# EAGLE design Fake6523 (EAGLE 7.7.0)

## Sheet 1 of 3: LOGIC
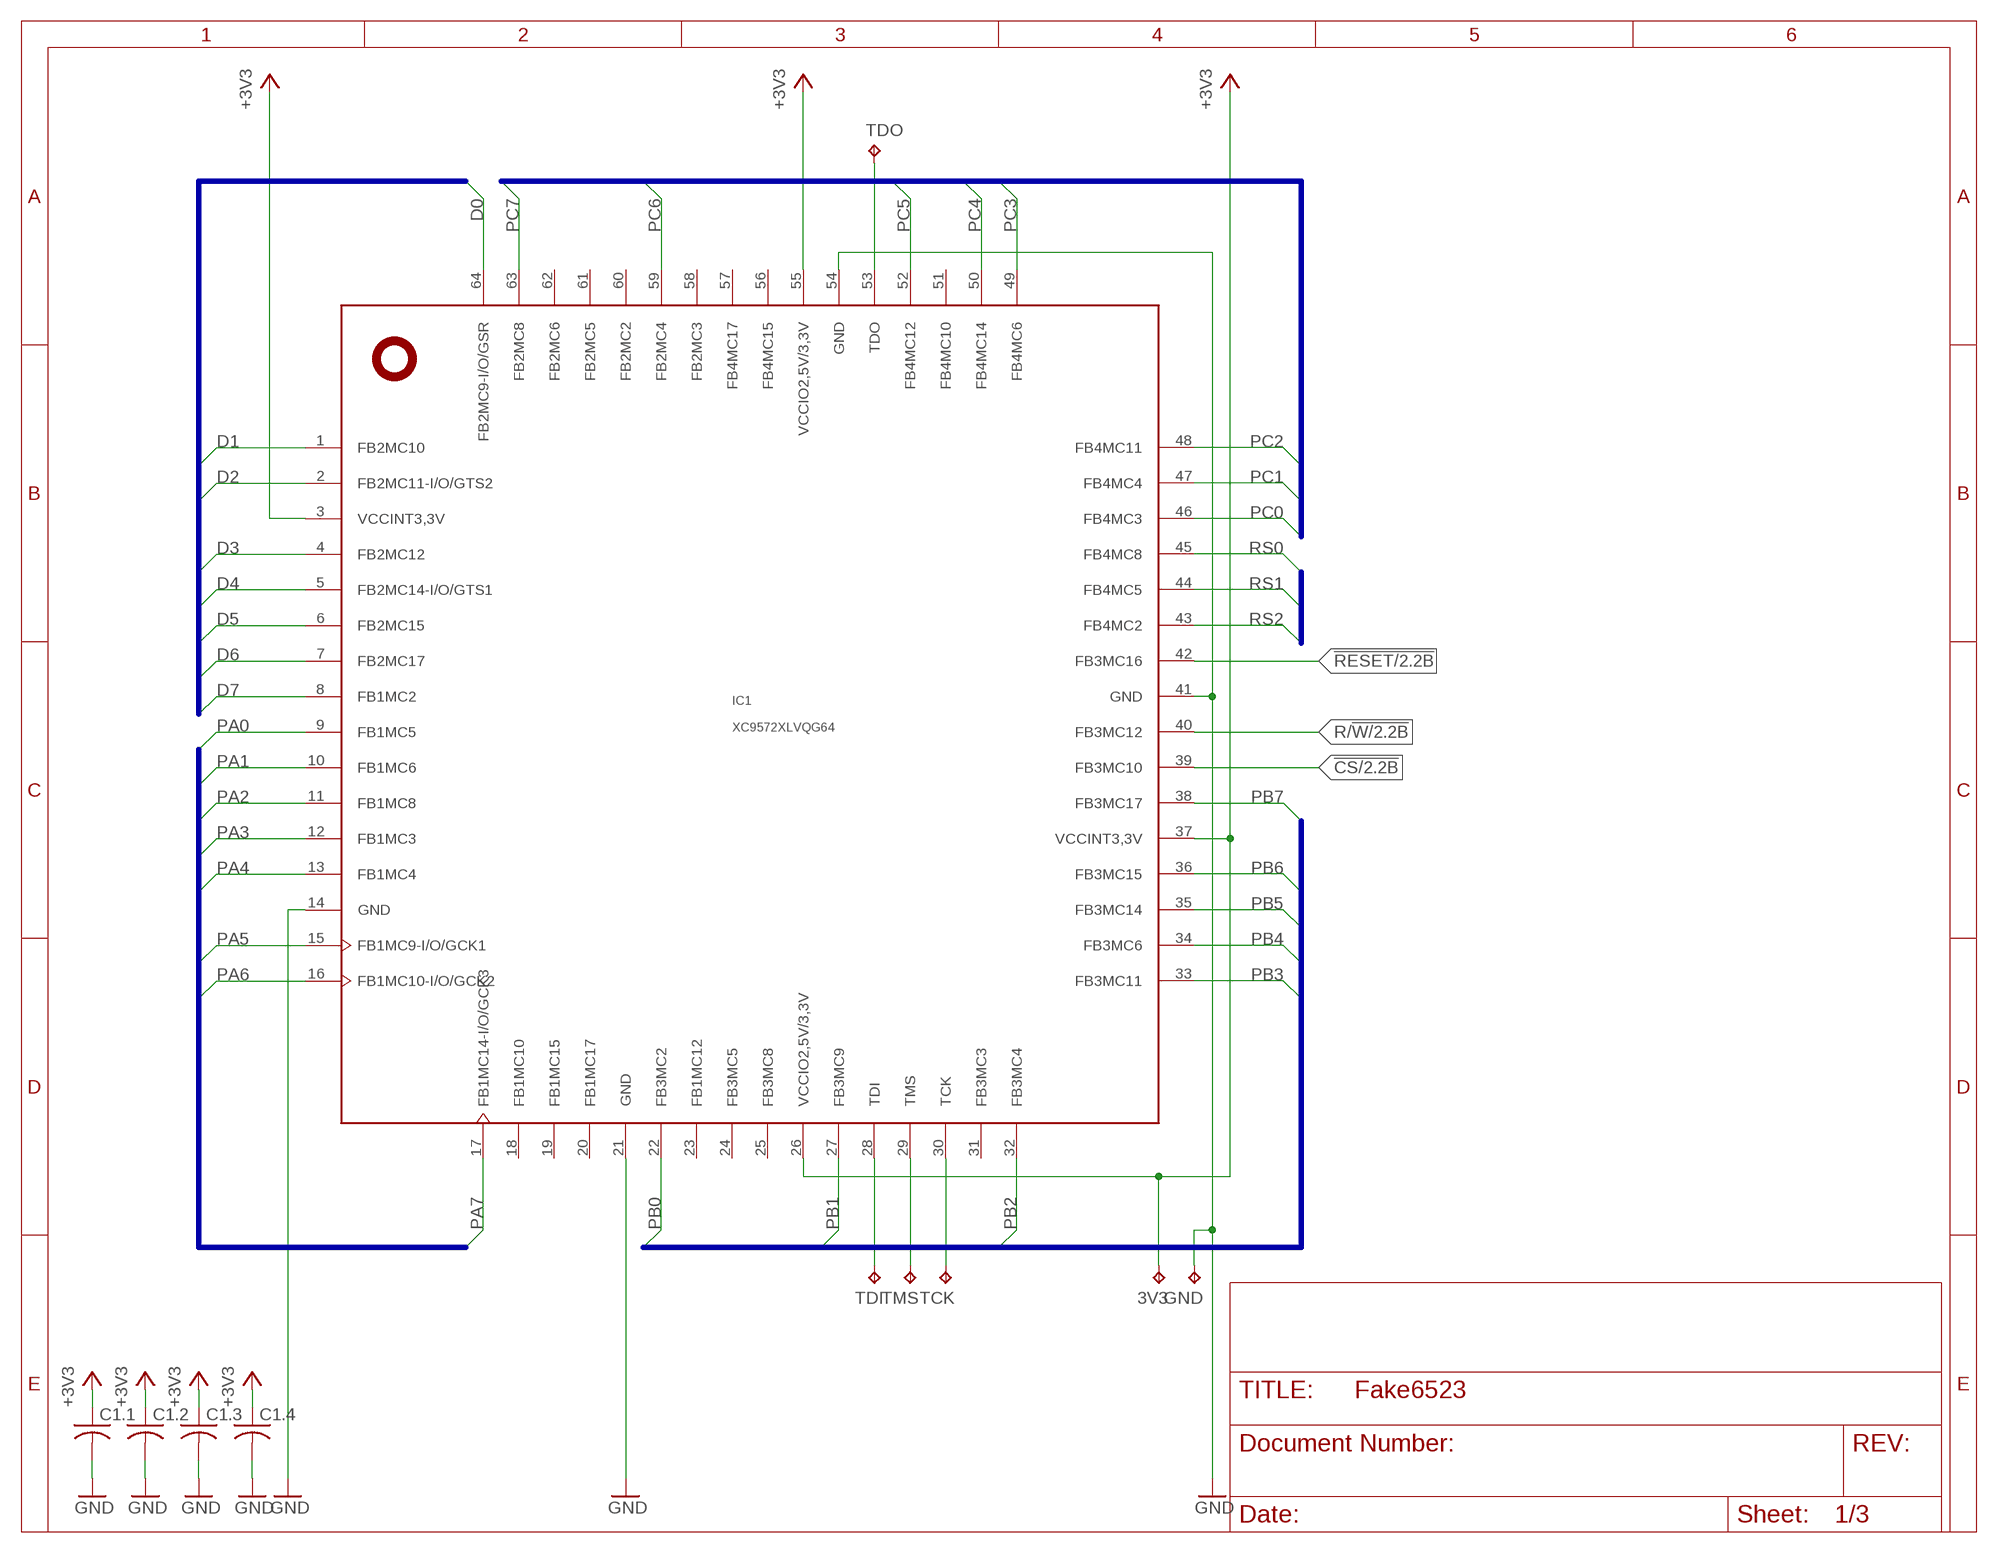
[diagram p0: schematic, sheet 1]

### Parts
3V3  TPTP08R  [TP08R]
C1.1  C-USC0402  [C0402]
C1.2  C-USC0402  [C0402]
C1.3  C-USC0402  [C0402]
C1.4  C-USC0402  [C0402]
GND  TPTP08R  [TP08R]
IC1  XC9572XLVQG64  [VQFP64]
TCK  TPTP08R  [TP08R]
TDI  TPTP08R  [TP08R]
TDO  TPTP08R  [TP08R]
TMS  TPTP08R  [TP08R]

### Nets
!CS: IC1.39(FB3MC10) ; also sheet 2
!RESET: IC1.42(FB3MC16) ; also sheet 2
+3V3: 3V3.TP C1.1.1 C1.2.1 C1.3.1 C1.4.1 IC1.3(VCCINT3,3V) IC1.26(VCCIO2,5V/3,3V) IC1.37(VCCINT3,3V) IC1.55(VCCIO2,5V/3,3V) ; also sheet 3
D0: IC1.64(FB2MC9-I/O/GSR) ; also sheet 2
D1: IC1.1(FB2MC10) ; also sheet 2
D2: IC1.2(FB2MC11-I/O/GTS2) ; also sheet 2
D3: IC1.4(FB2MC12) ; also sheet 2
D4: IC1.5(FB2MC14-I/O/GTS1) ; also sheet 2
D5: IC1.6(FB2MC15) ; also sheet 2
D6: IC1.7(FB2MC17) ; also sheet 2
D7: IC1.8(FB1MC2) ; also sheet 2
GND: C1.1.2 C1.2.2 C1.3.2 C1.4.2 GND.TP IC1.14(GND) IC1.21(GND) IC1.41(GND) IC1.54(GND) ; also sheet 2,3
PA0: IC1.9(FB1MC5) ; also sheet 2
PA1: IC1.10(FB1MC6) ; also sheet 2
PA2: IC1.11(FB1MC8) ; also sheet 2
PA3: IC1.12(FB1MC3) ; also sheet 2
PA4: IC1.13(FB1MC4) ; also sheet 2
PA5: IC1.15(FB1MC9-I/O/GCK1) ; also sheet 2
PA6: IC1.16(FB1MC10-I/O/GCK2) ; also sheet 2
PA7: IC1.17(FB1MC14-I/O/GCK3) ; also sheet 2
PB0: IC1.22(FB3MC2) ; also sheet 2
PB1: IC1.27(FB3MC9) ; also sheet 2
PB2: IC1.32(FB3MC4) ; also sheet 2
PB3: IC1.33(FB3MC11) ; also sheet 2
PB4: IC1.34(FB3MC6) ; also sheet 2
PB5: IC1.35(FB3MC14) ; also sheet 2
PB6: IC1.36(FB3MC15) ; also sheet 2
PB7: IC1.38(FB3MC17) ; also sheet 2
PC0: IC1.46(FB4MC3) ; also sheet 2
PC1: IC1.47(FB4MC4) ; also sheet 2
PC2: IC1.48(FB4MC11) ; also sheet 2
PC3: IC1.49(FB4MC6) ; also sheet 2
PC4: IC1.50(FB4MC14) ; also sheet 2
PC5: IC1.52(FB4MC12) ; also sheet 2
PC6: IC1.59(FB2MC4) ; also sheet 2
PC7: IC1.63(FB2MC8) ; also sheet 2
R/!W: IC1.40(FB3MC12) ; also sheet 2
RS0: IC1.45(FB4MC8) ; also sheet 2
RS1: IC1.44(FB4MC5) ; also sheet 2
RS2: IC1.43(FB4MC2) ; also sheet 2
TCK: IC1.30(TCK) TCK.TP
TDI: IC1.28(TDI) TDI.TP
TDO: IC1.53(TDO) TDO.TP
TMS: IC1.29(TMS) TMS.TP
Unconnected: IC1.18(FB1MC10) IC1.19(FB1MC15) IC1.20(FB1MC17) IC1.23(FB1MC12) IC1.24(FB3MC5) IC1.25(FB3MC8) IC1.31(FB3MC3) IC1.51(FB4MC10) IC1.56(FB4MC15) IC1.57(FB4MC17) IC1.58(FB2MC3) IC1.60(FB2MC2) IC1.61(FB2MC5) IC1.62(FB2MC6)

### Buses
PA[0..7]
PB[0..7]
PC[0..7]
D[0..7]
RS[0..2]

## Sheet 2 of 3: IO
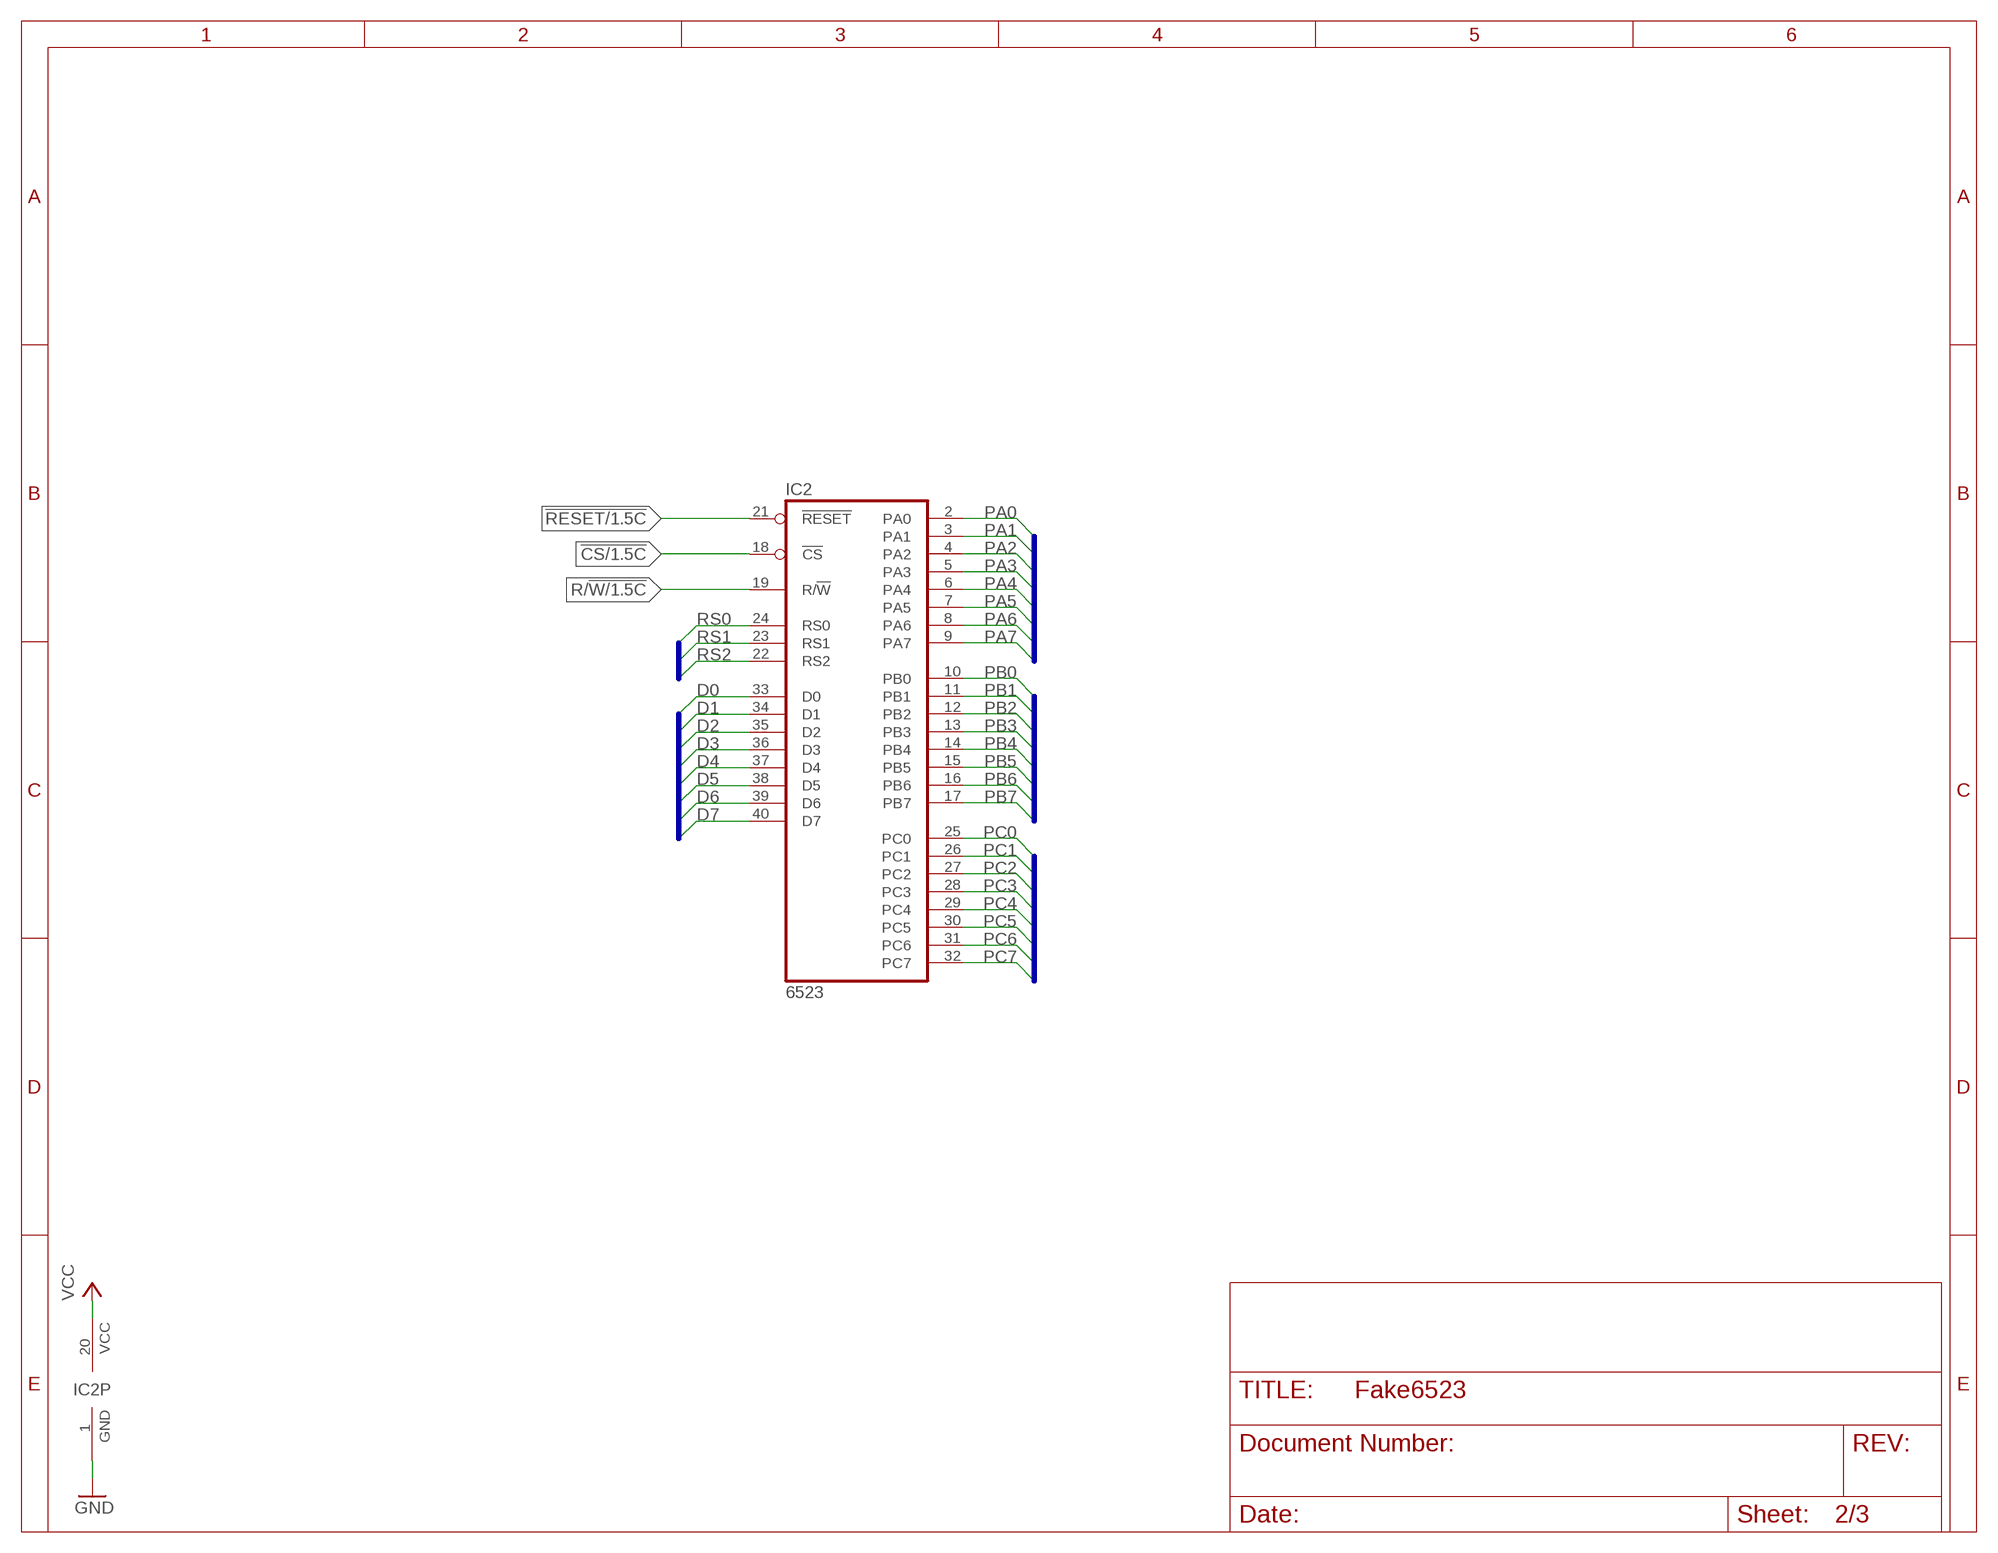
[diagram p1: schematic, sheet 2]

### Parts
IC2  6523  6523-R  [DIL40-ROUNDPAD]

### Nets
!CS: IC2.18(!CS) ; also sheet 1
!RESET: IC2.21(!RESET) ; also sheet 1
D0: IC2.33(D0) ; also sheet 1
D1: IC2.34(D1) ; also sheet 1
D2: IC2.35(D2) ; also sheet 1
D3: IC2.36(D3) ; also sheet 1
D4: IC2.37(D4) ; also sheet 1
D5: IC2.38(D5) ; also sheet 1
D6: IC2.39(D6) ; also sheet 1
D7: IC2.40(D7) ; also sheet 1
GND: IC2.1(GND) ; also sheet 1,3
PA0: IC2.2(PA0) ; also sheet 1
PA1: IC2.3(PA1) ; also sheet 1
PA2: IC2.4(PA2) ; also sheet 1
PA3: IC2.5(PA3) ; also sheet 1
PA4: IC2.6(PA4) ; also sheet 1
PA5: IC2.7(PA5) ; also sheet 1
PA6: IC2.8(PA6) ; also sheet 1
PA7: IC2.9(PA7) ; also sheet 1
PB0: IC2.10(PB0) ; also sheet 1
PB1: IC2.11(PB1) ; also sheet 1
PB2: IC2.12(PB2) ; also sheet 1
PB3: IC2.13(PB3) ; also sheet 1
PB4: IC2.14(PB4) ; also sheet 1
PB5: IC2.15(PB5) ; also sheet 1
PB6: IC2.16(PB6) ; also sheet 1
PB7: IC2.17(PB7) ; also sheet 1
PC0: IC2.25(PC0) ; also sheet 1
PC1: IC2.26(PC1) ; also sheet 1
PC2: IC2.27(PC2) ; also sheet 1
PC3: IC2.28(PC3) ; also sheet 1
PC4: IC2.29(PC4) ; also sheet 1
PC5: IC2.30(PC5) ; also sheet 1
PC6: IC2.31(PC6) ; also sheet 1
PC7: IC2.32(PC7) ; also sheet 1
R/!W: IC2.19(R/!W) ; also sheet 1
RS0: IC2.24(RS0) ; also sheet 1
RS1: IC2.23(RS1) ; also sheet 1
RS2: IC2.22(RS2) ; also sheet 1
VCC: IC2.20(VCC) ; also sheet 3

### Buses
PA[0..7]
PB[0..7]
PC[0..7]
D[0..7]
RS[0..2]

## Sheet 3 of 3: POWER
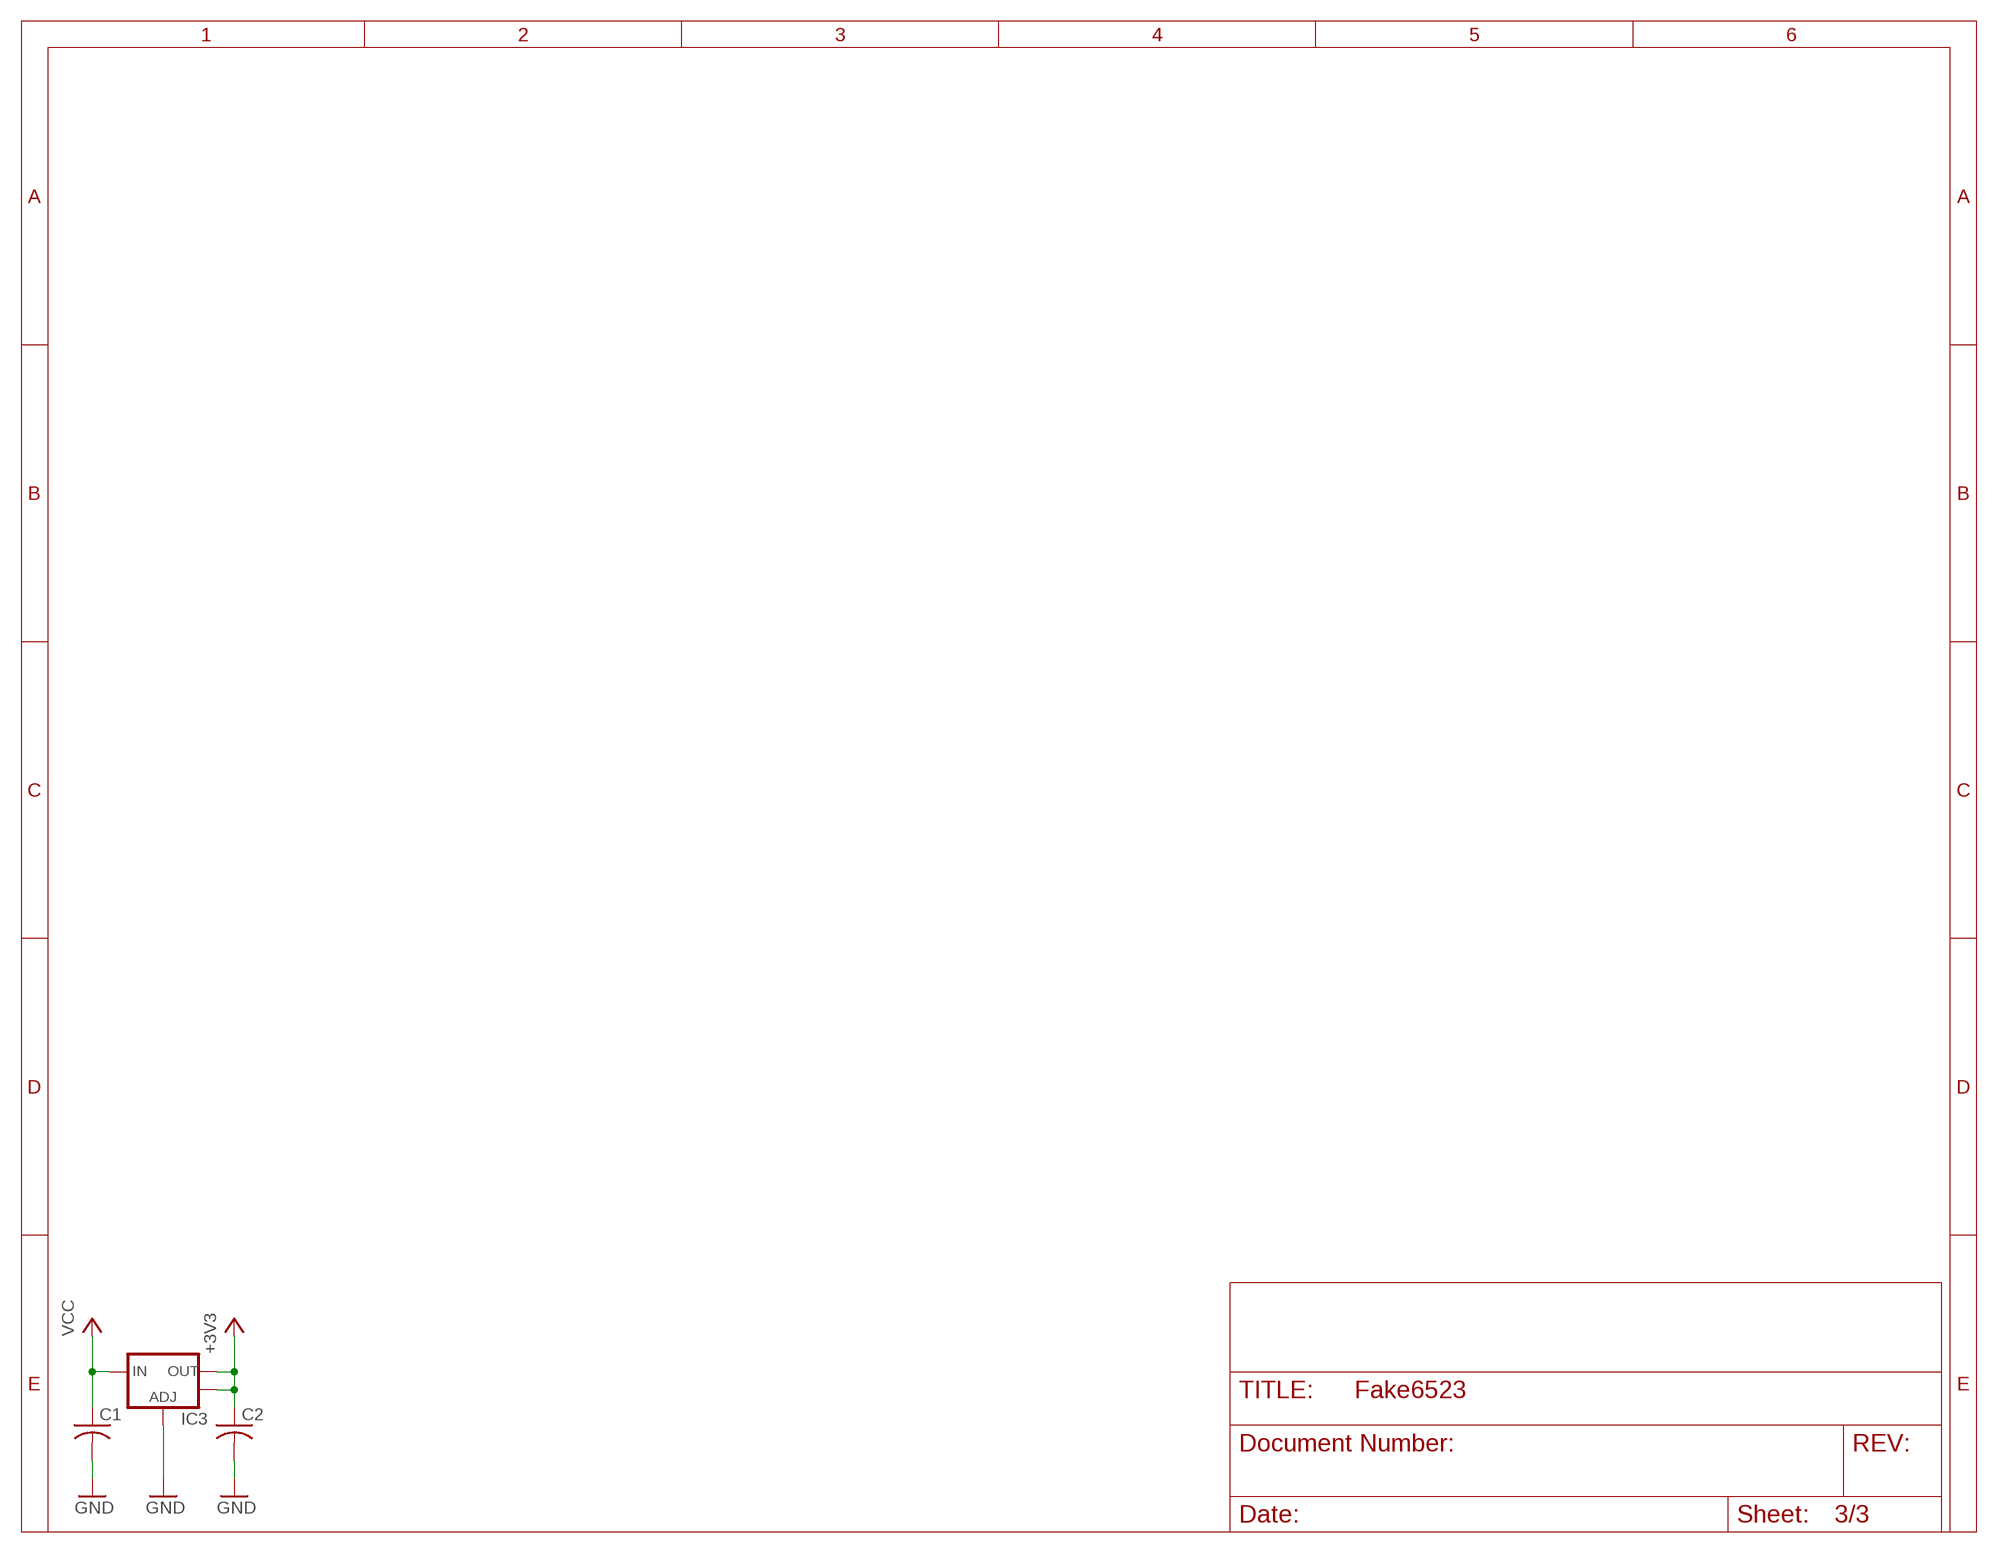
[diagram p2: schematic, sheet 3]

### Parts
C1  C-USC0805  [C0805]
C2  C-USC0805  [C0805]
IC3  V_REG_LM1117SOT223  [SOT223]

### Nets
+3V3: C2.1 IC3.2(OUT) IC3.4(OUT) ; also sheet 1
GND: C1.2 C2.2 IC3.1(ADJ) ; also sheet 1,2
VCC: C1.1 IC3.3(IN) ; also sheet 2

## Library data of the parts
3V3 GND TCK TDI TDO TMS = testpad:TP: Test pad
C1 C1.1-C1.4 C2 = resistor:C-US: CAPACITOR, American symbol
IC1 = xilinx_xc95XXXxl:XC9572XLVQG64
IC2 = commodore:6523
IC3 = SparkFun:V_REG_LM1117: Voltage Regulator LM1117 Standard adjustable voltage regulator but in SMD form. Spark Fun Electronics SKU : COM-00595

## Board
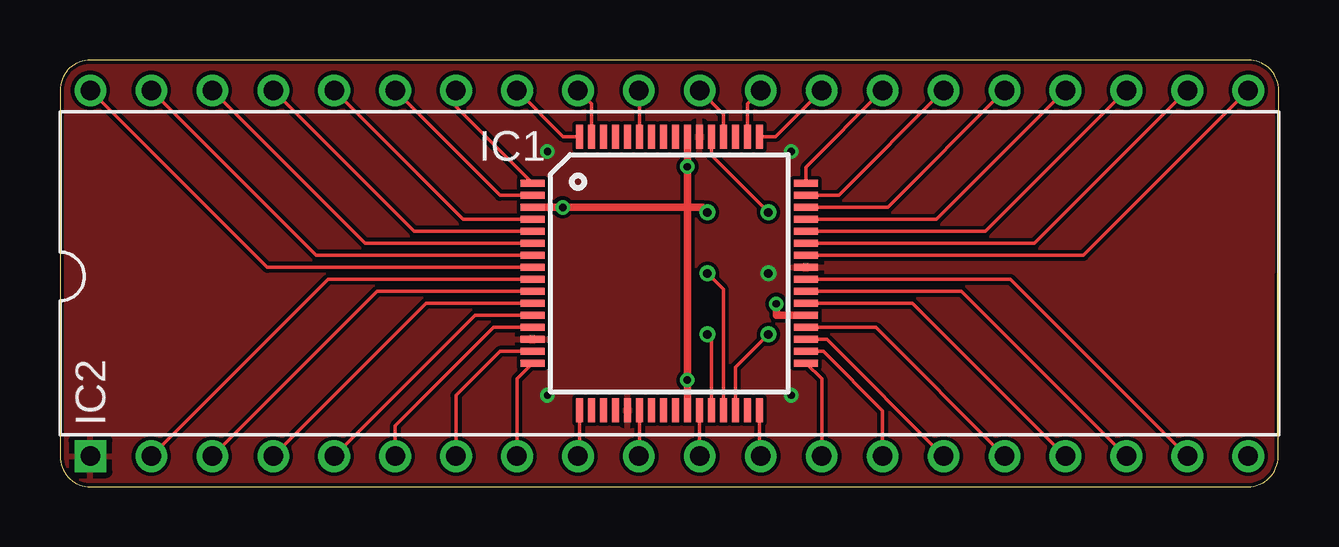
[diagram p3: board, top side]
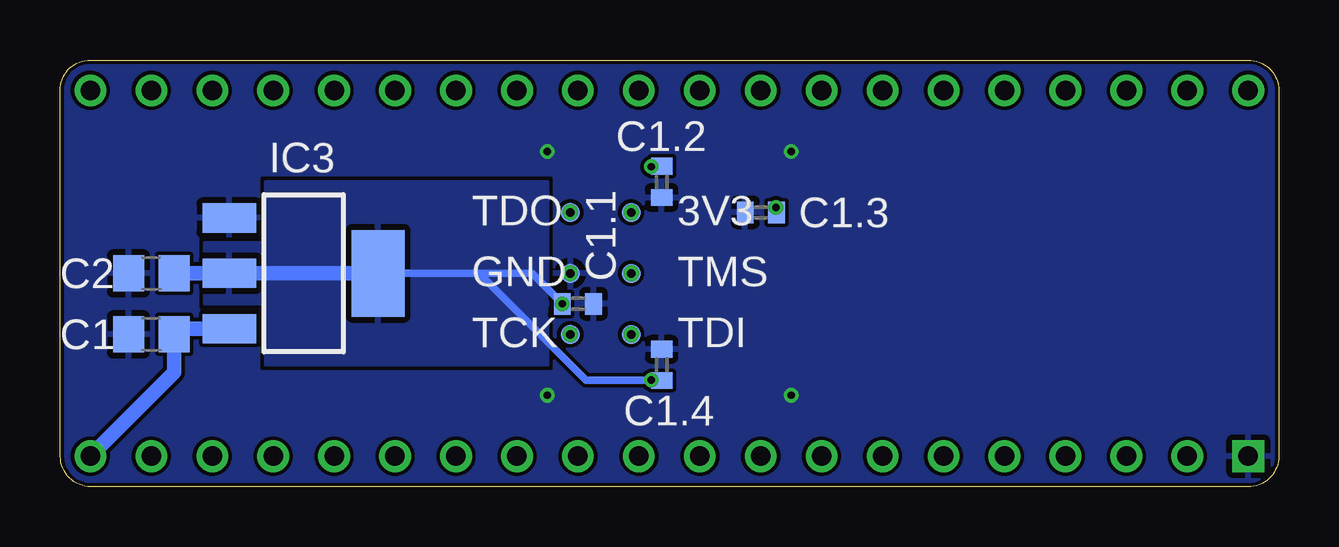
[diagram p4: board, bottom side, seen from below]

Size 50.8 x 17.78 mm. Coordinates in mm from the lower left corner, seen from the top.
Outline: 0,16.51 0,1.27 arc90 1.27,0 49.51,0 arc90 50.78,1.27 50.8,16.51 arc90 49.53,17.78 1.27,17.78 arc90 0,16.51
Copper layers (1*16): Top 0.035mm / dielectric 1.5mm / Bottom 0.035mm
Design rules "hackvana": minimum track width 6mil, minimum drill 0.3mm, track to track 6mil, track to pad 6mil, pad to pad 6mil, via to via 6mil, smd to smd 0mil, copper to edge 6mil, drill to drill 6mil, minimum pad ring 10mil, minimum via ring 6mil, stop-mask expansion 2mil, vias tented up to drill 100mil, thermal gap 10mil

### Footprints (pad centres in the part's own frame; a part is rotated, then mirrored left to right if it is on the bottom)
TP08R = smd 0.8 x 0.8: TP 0,0
C0805 = smd 1.3 x 1.5: 1 -0.95,0; 2 0.95,0
C0402 = smd 0.7 x 0.9: 1 -0.65,0; 2 0.65,0
VQFP64 = smd 1 x 0.3: 1 -5.7,3.75; 2 -5.7,3.25; 3 -5.7,2.75; 4 -5.7,2.25; 5 -5.7,1.75; 6 -5.7,1.25; 7 -5.7,0.75; 8 -5.7,0.25; 9 -5.7,-0.25; 10 -5.7,-0.75; 11 -5.7,-1.25; 12 -5.7,-1.75; 13 -5.7,-2.25; 14 -5.7,-2.75; 15 -5.7,-3.25; 16 -5.7,-3.75; 33 5.7,-3.75; 34 5.7,-3.25; 35 5.7,-2.75; 36 5.7,-2.25; 37 5.7,-1.75; 38 5.7,-1.25; 39 5.7,-0.75; 40 5.7,-0.25; 41 5.7,0.25; 42 5.7,0.75; 43 5.7,1.25; 44 5.7,1.75; 45 5.7,2.25; 46 5.7,2.75; 47 5.7,3.25; 48 5.7,3.75 | smd 0.3 x 1: 17 -3.75,-5.7; 18 -3.25,-5.7; 19 -2.75,-5.7; 20 -2.25,-5.7; 21 -1.75,-5.7; 22 -1.25,-5.7; 23 -0.75,-5.7; 24 -0.25,-5.7; 25 0.25,-5.7; 26 0.75,-5.7; 27 1.25,-5.7; 28 1.75,-5.7; 29 2.25,-5.7; 30 2.75,-5.7; 31 3.25,-5.7; 32 3.75,-5.7; 49 3.75,5.7; 50 3.25,5.7; 51 2.75,5.7; 52 2.25,5.7; 53 1.75,5.7; 54 1.25,5.7; 55 0.75,5.7; 56 0.25,5.7; 57 -0.25,5.7; 58 -0.75,5.7; 59 -1.25,5.7; 60 -1.75,5.7; 61 -2.25,5.7; 62 -2.75,5.7; 63 -3.25,5.7; 64 -3.75,5.7
DIL40-ROUNDPAD = drill 0.813 square: 1 -24.13,-7.62 | drill 0.813: 2 -21.59,-7.62; 3 -19.05,-7.62; 4 -16.51,-7.62; 5 -13.97,-7.62; 6 -11.43,-7.62; 7 -8.89,-7.62; 8 -6.35,-7.62; 9 -3.81,-7.62; 10 -1.27,-7.62; 11 1.27,-7.62; 12 3.81,-7.62; 13 6.35,-7.62; 14 8.89,-7.62; 15 11.43,-7.62; 16 13.97,-7.62; 17 16.51,-7.62; 18 19.05,-7.62; 19 21.59,-7.62; 20 24.13,-7.62; 21 24.13,7.62; 22 21.59,7.62; 23 19.05,7.62; 24 16.51,7.62; 25 13.97,7.62; 26 11.43,7.62; 27 8.89,7.62; 28 6.35,7.62; 29 3.81,7.62; 30 1.27,7.62; 31 -1.27,7.62; 32 -3.81,7.62; 33 -6.35,7.62; 34 -8.89,7.62; 35 -11.43,7.62; 36 -13.97,7.62; 37 -16.51,7.62; 38 -19.05,7.62; 39 -21.59,7.62; 40 -24.13,7.62
SOT223 = smd 1.219 x 2.235: 1 -2.311,-3.099; 2 0,-3.099; 3 2.311,-3.099 | smd 3.6 x 2.2: 4 0,3.099

### Placement (x,y rotation side)
3V3  26.99,11.43 0 bottom
C1  46.99,6.35 180 bottom
C1.1  29.21,7.62 0 bottom
C1.2  25.72,12.7 270 bottom
C1.3  21.59,11.43 180 bottom
C1.4  25.72,5.08 90 bottom
C2  46.99,8.89 180 bottom
GND  29.53,8.89 0 bottom
IC1  25.4,8.89 0 top
IC2  25.4,8.89 0 top
IC3  40.64,8.89 270 bottom
TCK  29.53,6.35 0 bottom
TDI  26.99,6.35 0 bottom
TDO  29.53,11.43 0 bottom
TMS  26.99,8.89 0 bottom

### Tracks (layer width: path | path; a pad name or v marks a point on that pad's centre or on a via)
!CS
  Top 0.152: IC1.39 37.58,8.14 IC2.18
!RESET
  Top 0.152: IC1.42 42.66,9.64 IC2.21
+3V3  (via drill 0.3, 0.36)
  Top 0.305: 26.15,11.64 v26.15,13.34 IC1.55 | 26.15,11.64 v20.95,11.64 IC1.3 | 26.15,11.64 v26.15,4.45 IC1.26 | IC1.37 29.86,7.14 C1.1.1 | 26.15,11.64 26.78,11.64 3V3.TP
  Bottom 0.305: 33.34,8.89 31.77,8.89 31.13,8.89 C1.1.1 | C1.4.1 26.14,4.43 | 26.14,4.43 v26.15,4.45 | C1.3.1 20.94,11.62 v20.95,11.64 | C1.2.1 26.14,13.35 v26.15,13.34 | 33.34,8.89 IC3.4 | 26.14,4.43 28.88,4.43 33.34,8.89
  Bottom 0.61: C2.1 IC3.2 IC3.4
  other vias: 26.99,11.43 29.86,7.62
  pour Bottom: 30.48,12.7 42.23,12.7 42.23,10.16 44.77,10.16 44.77,7.62 42.23,7.62 42.23,5.08 30.48,5.08
D0
  Top 0.152: IC2.33 20.97,14.59 IC1.64
D1
  Top 0.152: IC2.34 16.51,15.83 IC1.1
D2
  Top 0.152: IC1.2 18.34,12.14 IC2.35
D3
  Top 0.152: IC1.4 16.8,11.14 IC2.36
D4
  Top 0.152: IC1.5 14.76,10.64 IC2.37
D5
  Top 0.152: IC1.6 12.72,10.14 IC2.38
D6
  Top 0.152: IC1.7 10.68,9.64 IC2.39
D7
  Top 0.152: IC1.8 8.64,9.14 IC2.40
GND  (via drill 0.3, 0.36)
  other vias: 20.32,13.97 30.48,13.97 20.32,3.81 30.48,3.81 29.53,8.89
  pour Bottom (rank 2): 1.27,17.78 49.53,17.78 arc-90 50.8,16.51 50.8,1.27 arc-90 49.53,0 1.27,0 arc-90 0,1.27 0,16.51 arc-90
  pour Top: 1.27,17.78 49.53,17.78 arc-90 50.8,16.51 50.8,1.27 arc-90 49.53,0 1.27,0 arc-90 0,1.27 0,16.51 arc-90
PA0
  Top 0.152: IC1.9 11.18,8.64 IC2.2
PA1
  Top 0.152: IC1.10 13.22,8.14 IC2.3
PA2
  Top 0.152: IC1.11 15.26,7.64 IC2.4
PA3
  Top 0.152: IC1.12 17.3,7.14 IC2.5
PA4
  Top 0.152: IC1.13 18.07,6.64 13.97,2.54 IC2.6
PA5
  Top 0.152: IC1.15 18.34,5.64 16.51,3.81 IC2.7
PA6
  Top 0.152: IC2.8 19.05,4.49 IC1.16
PA7
  Top 0.152: IC1.17 21.65,1.33 IC2.9
PB0
  Top 0.152: IC1.22 24.15,1.29 IC2.10
PB1
  Top 0.152: IC1.27 26.65,1.29 IC2.11
PB2
  Top 0.152: IC1.32 29.15,1.33 IC2.12
PB3
  Top 0.152: IC1.33 31.75,4.49 IC2.13
PB4
  Top 0.152: IC1.34 31.82,5.64 34.29,3.17 IC2.14
PB5
  Top 0.152: IC1.35 31.96,6.14 IC2.15
PB6
  Top 0.152: IC1.36 34,6.64 IC2.16
PB7
  Top 0.152: IC1.38 35.54,7.64 IC2.17
PC0
  Top 0.152: IC1.46 34.5,11.64 IC2.25
PC1
  Top 0.152: IC1.47 32.46,12.14 IC2.26
PC2
  Top 0.152: IC1.48 31.1,13.32 IC2.27
PC3
  Top 0.152: IC2.28 29.83,14.59 IC1.49
PC4
  Top 0.152: IC2.29 28.65,15.95 IC1.50
PC5
  Top 0.152: IC1.52 27.65,15.53 IC2.30
PC6
  Top 0.152: IC2.31 24.15,16.49 IC1.59
PC7
  Top 0.152: IC2.32 22.15,15.95 IC1.63
R/!W
  Top 0.152: IC1.40 39.62,8.64 IC2.19
RS0
  Top 0.152: IC1.45 36.54,11.14 IC2.24
RS1
  Top 0.152: IC1.44 38.58,10.64 IC2.23
RS2
  Top 0.152: IC1.43 40.62,10.14 IC2.22
TCK  (via drill 0.36)
  Top 0.152: IC1.30 28.15,4.97 TCK.TP
  other vias: 29.53,6.35
TDI  (via drill 0.36)
  Top 0.152: IC1.28 27.15,6.19 TDI.TP
  other vias: 26.99,6.35
TDO  (via drill 0.36)
  Top 0.152: IC1.53 27.15,13.81 TDO.TP
  other vias: 29.53,11.43
TMS  (via drill 0.36)
  Top 0.152: IC1.29 27.65,8.23 TMS.TP
  other vias: 26.99,8.89
VCC
  Bottom 0.61: IC3.3 45.81,6.58 C1.1 46.04,4.76 IC2.20